# EAGLE design Arduino Breakout Shield (EAGLE 6.2)
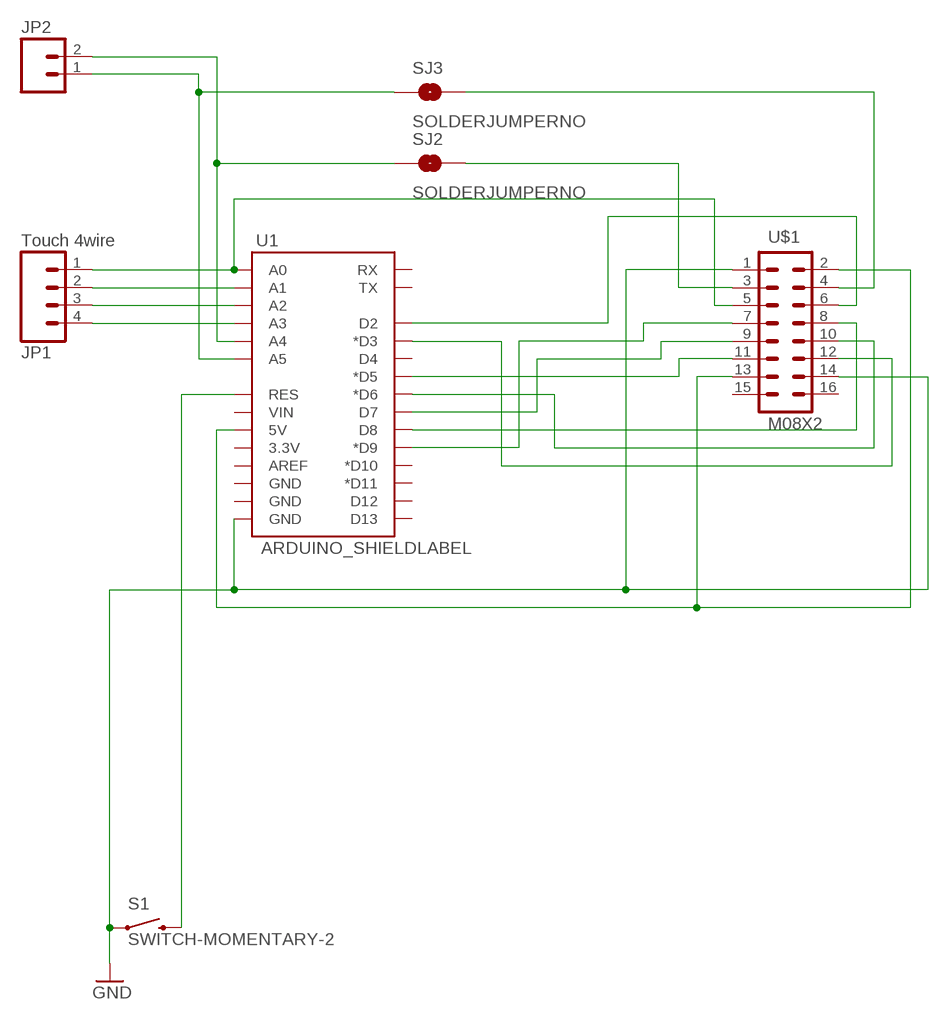
[diagram p0: schematic, sheet 1]

## Parts
JP1  Touch 4wire  M04PTH  [1X04]
JP2  M02PTH  [1X02]
S1  SWITCH-MOMENTARY-2  [TACTILE_SWITCH_TALL]
SJ2  SOLDERJUMPERNO  [SJ_2S-NO]
SJ3  SOLDERJUMPERNO  [SJ_2S-NO]
U1  ARDUINO_SHIELDLABEL  [DUEMILANOVE_SHIELD]
U$1  M08X2  [2X8]

## Nets
GND: S1.A2 U1.GND@0(GND) U$1.1 U$1.14
N$1: U1.D9(*D9) U$1.7
N$2: U1.5V U$1.2 U$1.13
N$3: JP2.2 SJ2.1 U1.A4
N$4: JP2.1 SJ3.1 U1.A5
N$5: JP1.1 U1.A0 U$1.5
N$6: U1.D2 U$1.6
N$7: U1.D5(*D5) U$1.11
N$8: U1.D8 U$1.8
N$9: U1.D7 U$1.9
N$10: U1.D6(*D6) U$1.10
N$11: JP1.2 U1.A1
N$12: U1.D3(*D3) U$1.12
N$13: SJ3.2 U$1.4
N$14: JP1.3 U1.A2
N$15: JP1.4 U1.A3
N$16: SJ2.2 U$1.3
N$23: S1.B2 U1.RES
Unconnected: U1.3.3V U1.AREF U1.D4 U1.D10(*D10) U1.D11(*D11) U1.D12 U1.D13 U1.GND@1(GND) U1.GND@2(GND) U1.RX U1.TX U1.VIN U$1.15 U$1.16

## Library data of the parts
JP1 = SparkFun:M04: Header 4 Standard 4-pin 0.1" header. Use with straight break away headers (SKU : PRT-00116), right angle break away headers (PRT-00553), swiss pins (PRT-00743), machine pins (PRT-00117), and female headers (PRT-00115). Molex polarized connector foot print use with SKU : PRT-08231 with associated crimp pins and housings. 1MM SMD Version SKU: PRT-10208
JP2 = SparkFun:M02: Header 2 Standard 2-pin 0.1" header. Use with straight break away headers (SKU : PRT-00116), right angle break away headers (PRT-00553), swiss pins (PRT-00743), machine pins (PRT-00117), and female headers (PRT-00115). Molex polarized connector foot print use with SKU : PRT-08233 with associated crimp pins and housings.
S1 = SparkFun:SWITCH-MOMENTARY-2
SJ2 SJ3 = SparkFun:SOLDERJUMPER: Solder Jumper Standard SMD solder jumper. Used to automate production. Two varients : Normally Open and Normally Closed are the same, but have different paste layers. NC will have a large amount of paste and should jumper during reflow.
U1 = SparkFun:ARDUINO_SHIELD
U$1 = SparkFun:M08X2

## Net classes
0 default: width 0.254 mm, clearance 0.254 mm

## Board
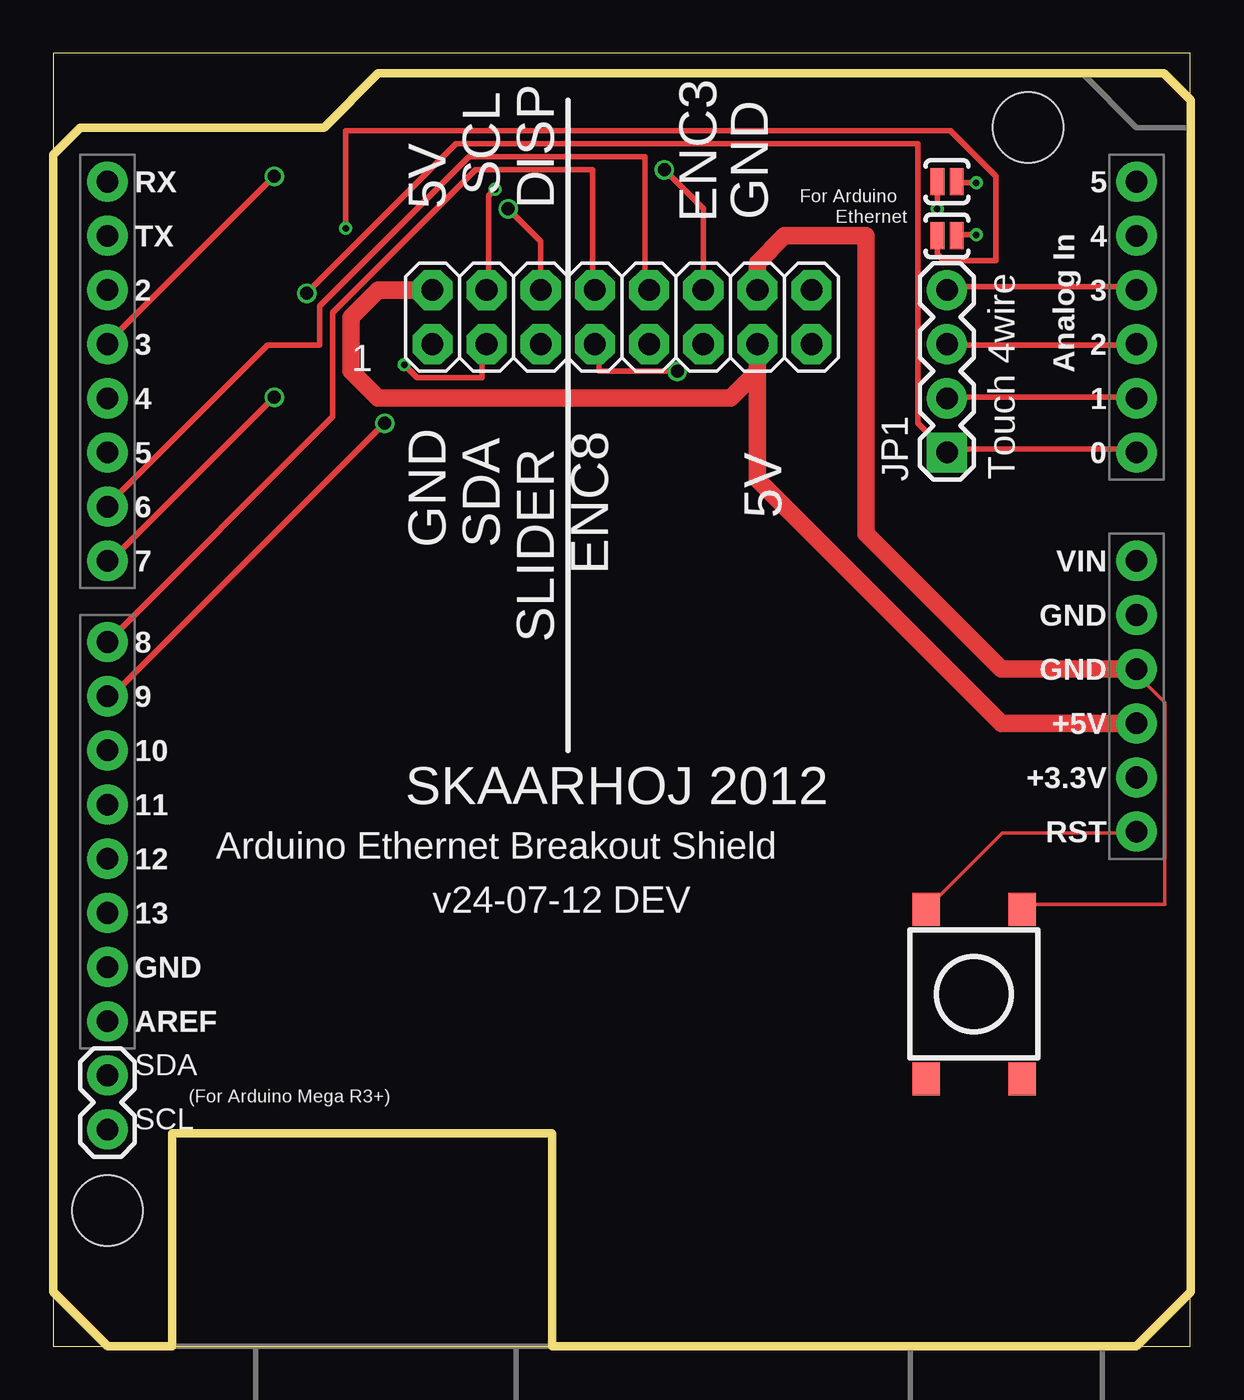
[diagram p1: board, top side]
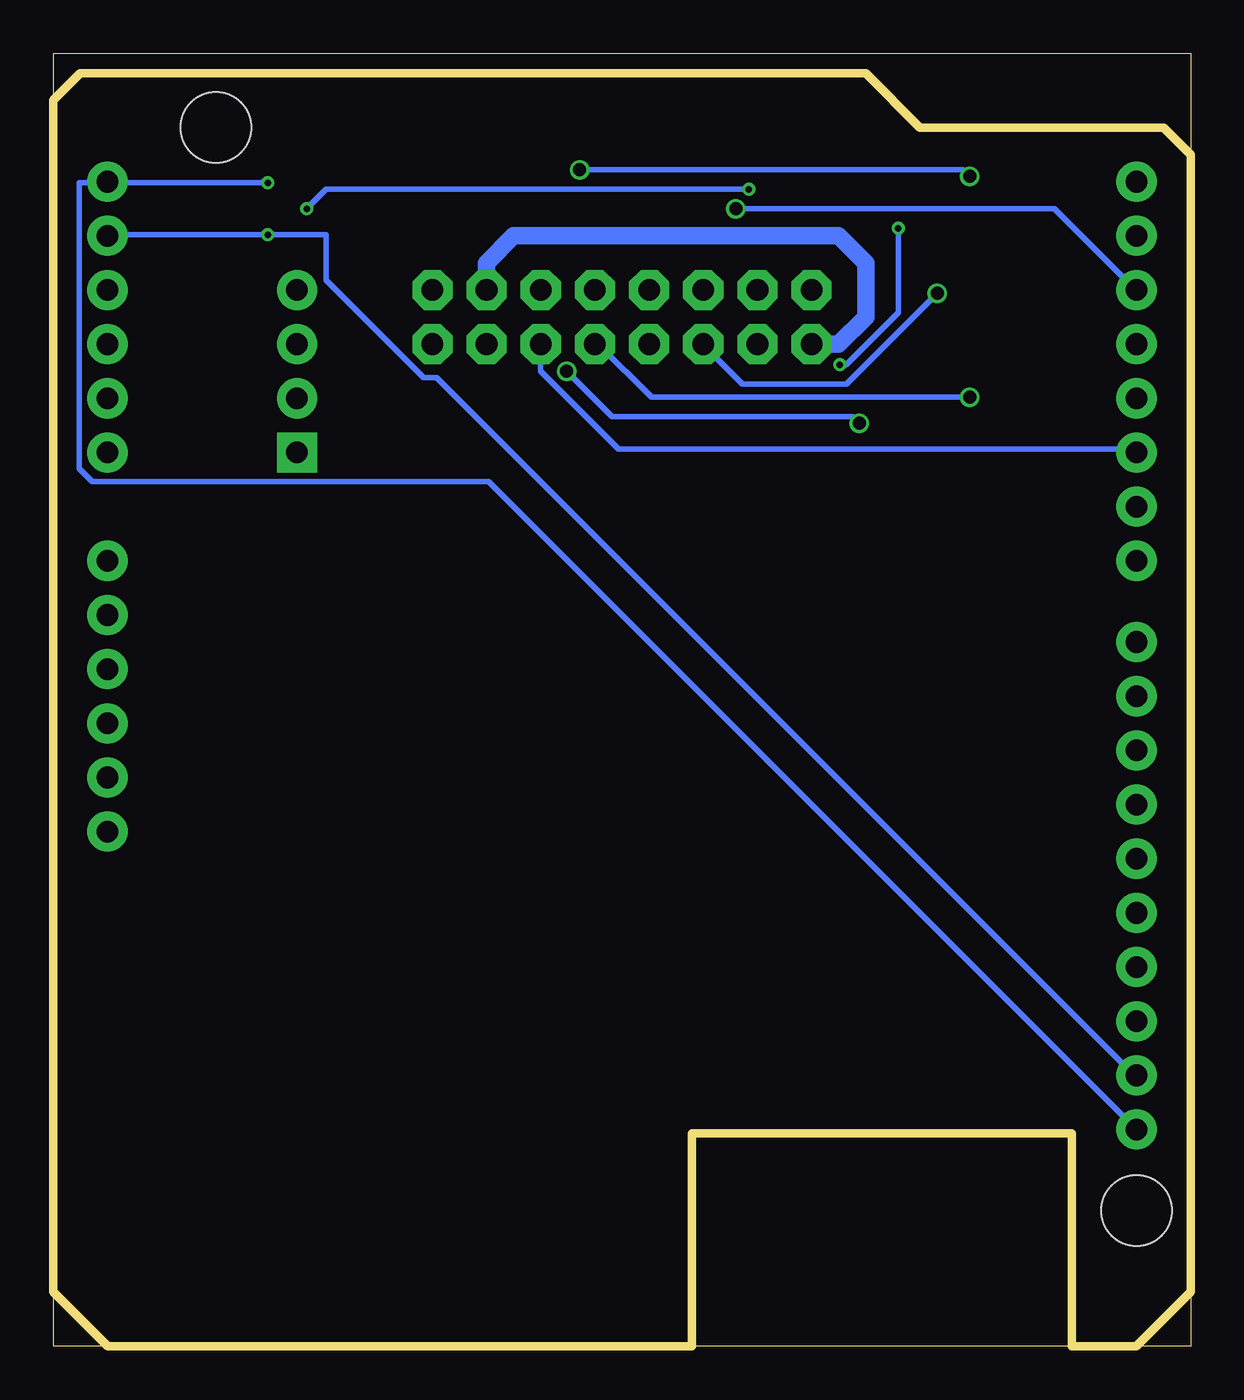
[diagram p2: board, bottom side, seen from below]

Size 53.34 x 60.63 mm. Coordinates in mm from the lower left corner, seen from the top.
Outline: 2.54,0 0,0 0,2.54
Outline: 5.58,0 23.4,0
Outline: 50.8,0 53.32,0 53.32,60.63 0,60.63 0,55.88
Outline: 0,2.54 2.54,0
Outline: 2.54,0 5.58,0
Outline: 5.58,0 5.58,9.97 23.4,9.97 23.4,0
Outline: 23.4,0 50.8,0
Outline: 50.8,0 53.34,2.54 53.34,58.42 52.07,59.69 15.24,59.69 12.7,57.15 1.27,57.15 0,55.88
Outline: 0,55.88 0,2.54
Copper layers (1*16): Top 0.035mm / dielectric 1.5mm / Bottom 0.035mm
Design rules: minimum track width 6mil, minimum drill 12mil, track to track 6mil, track to pad 6mil, pad to pad 6mil, via to via 6mil, smd to smd 0mil, copper to edge 10mil, drill to drill 10mil, minimum pad ring 10mil, minimum via ring 6mil, stop-mask expansion 2mil, vias tented up to drill 100mil, thermal gap 10mil

### Footprints (pad centres in the part's own frame; a part is rotated, then mirrored left to right if it is on the bottom)
1X04 = drill 1.016 pad 1.88 square: 1 0,0 | drill 1.016 pad 1.88: 2 2.54,0; 3 5.08,0; 4 7.62,0
1X02 = drill 1.016 pad 1.88: 1 0,0; 2 2.54,0
TACTILE_SWITCH_TALL = smd 1.55 x 1.3: A1 -3.975,-2.25; A2 3.975,-2.25; B1 -3.975,2.25; B2 3.975,2.25
SJ_2S-NO = smd 0.635 x 1.27: 1 -0.45,0; 2 0.45,0
DUEMILANOVE_SHIELD = drill 1.016 pad 1.88: 3.3V 50.8,26.67; 5V 50.8,29.21; A0 50.8,41.91; A1 50.8,44.45; A2 50.8,46.99; A3 50.8,49.53; A4 50.8,52.07; A5 50.8,54.61; AREF 2.54,15.24; D2 2.54,49.53; D3 2.54,46.99; D4 2.54,44.45; D5 2.54,41.91; D6 2.54,39.37; D7 2.54,36.83; D8 2.54,33.02; D9 2.54,30.48; D10 2.54,27.94; D11 2.54,25.4; D12 2.54,22.86; D13 2.54,20.32; GND@0 50.8,31.75; GND@1 50.8,34.29; GND@2 2.54,17.78; RES 50.8,24.13; RX 2.54,54.61; TX 2.54,52.07; VIN 50.8,36.83 | hole 3.302: 45.72,57.15; 2.54,6.35
2X8 = drill 1.016 pad 1.88 octagon: 1 0,0; 2 0,2.54; 3 2.54,0; 4 2.54,2.54; 5 5.08,0; 6 5.08,2.54; 7 7.62,0; 8 7.62,2.54; 9 10.16,0; 10 10.16,2.54; 11 12.7,0; 12 12.7,2.54; 13 15.24,0; 14 15.24,2.54; 15 17.78,0; 16 17.78,2.54

### Placement (x,y rotation side)
JP1  41.91,41.91 90 top
JP2  2.54,10.16 90 top
S1  43.18,16.51 90 top
SJ2  41.91,52.07 180 top
SJ3  41.91,54.61 180 top
U1  0,0 0 top
U$1  17.78,46.99 0 top

### Tracks (layer width: path | path; a pad name or v marks a point on that pad's centre or on a via)
GND
  Top 0.152: S1.A2 45.72,20.73 52.12,20.73 52.12,30.18 50.9,31.39 U1.GND@0
  Top 0.813: U1.GND@0 44.45,31.75 38.1,38.1 38.1,52.07 34.29,52.07 33.02,50.8 U$1.14
  Bottom 0.813: U$1.1 16.51,46.99 15.24,48.26 15.24,50.8 16.51,52.07 31.75,52.07 33.02,50.8 U$1.14
N$1  (via drill 0.61)
  Top 0.254: v15.54,43.28 2.74,30.48 U1.D9 | v29.26,45.72 25.6,45.72 25.6,46.94 U$1.7
  Bottom 0.254: v15.54,43.28 15.85,43.59 27.13,43.59 v29.26,45.72
N$2
  Top 0.813: U1.5V 44.45,29.21 33.02,40.64 U$1.13 33.02,45.72 31.75,44.45 15.24,44.45 13.97,45.72 13.97,48.26 15.24,49.53 U$1.2
N$3  (via drill 0.3)
  Top 0.254: v43.28,52.12 42.37,52.12 SJ2.1
  Bottom 0.254: U1.A4 50.6,52.12 v43.28,52.12 40.54,52.12 40.54,49.99 35.97,45.41 35.36,45.41 2.74,12.8 JP2.2
N$4  (via drill 0.3)
  Top 0.254: v43.28,54.56 42.37,54.56 SJ3.1
  Bottom 0.254: v43.28,54.56 50.6,54.56 U1.A5 50.9,54.56 52.12,54.56 52.12,41.15 51.51,40.54 32.92,40.54 JP2.1
N$5  (via drill 0.61)
  Top 0.254: U1.A0 50.6,42.06 42.06,42.06 JP1.1 40.54,43.28 40.54,56.39 18.9,56.39 v11.89,49.38
  Bottom 0.254: v11.89,49.38 16.15,45.11 21.03,45.11 22.86,46.94 U$1.5
N$6  (via drill 0.61)
  Top 0.254: v21.34,53.34 22.86,51.82 U$1.6
  Bottom 0.254: v21.34,53.34 6.4,53.34 2.74,49.68 U1.D2
N$7
  Bottom 0.254: U$1.11 30.48,45.72 26.82,42.06 2.74,42.06 U1.D5
N$8
  Top 0.254: U1.D8 13.11,43.59 13.11,48.46 19.81,55.17 25.3,55.17 25.3,49.68 U$1.8
N$9  (via drill 0.61)
  Top 0.254: v10.36,44.5 2.74,36.88 U1.D7
  Bottom 0.254: v10.36,44.5 25.3,44.5 27.74,46.94 U$1.9
N$10
  Top 0.254: U1.D6 2.74,39.62 10.06,46.94 12.5,46.94 12.5,48.77 19.51,55.78 27.74,55.78 27.74,49.68 U$1.10
N$11
  Top 0.254: JP1.2 42.06,44.5 50.6,44.5 U1.A1
N$12  (via drill 0.61)
  Top 0.254: v10.36,54.86 2.74,47.24 U1.D3 | v28.65,55.17 30.48,53.34 U$1.12
  Bottom 0.254: v10.36,54.86 10.67,55.17 v28.65,55.17
N$13  (via drill 0.3)
  Top 0.254: v41.45,53.34 41.45,54.56 SJ3.2 | v20.73,54.25 20.42,53.95 20.42,49.68 U$1.4
  Bottom 0.254: v41.45,53.34 40.54,54.25 v20.73,54.25
N$14
  Top 0.254: JP1.3 42.06,46.94 50.6,46.94 U1.A2
N$15
  Top 0.254: JP1.4 42.06,49.68 50.6,49.68 U1.A3
N$16  (via drill 0.3)
  Top 0.254: v13.72,52.43 13.72,57 42.06,57 44.2,54.86 44.2,50.9 41.76,50.9 41.45,51.21 41.45,51.82 SJ2.2 | v16.46,46.02 17.07,45.41 20.12,45.41 20.12,46.94 U$1.3
  Bottom 0.254: v13.72,52.43 13.72,48.46 16.15,46.02 v16.46,46.02
N$23
  Top 0.152: S1.B2 41.15,20.73 44.5,24.08 50.6,24.08 U1.RES

### Text on the board
_tsilk: GND | SCL | For Arduino | 5V | DISP | ENC3 | Ethernet | 1 | 5V | GND | SDA | ENC8 | SLIDER | SKAARHOJ 2012 | Arduino Ethernet Breakout Shield | v24-07-12 DEV | SDA | (For Arduino Mega R3+) | SCL